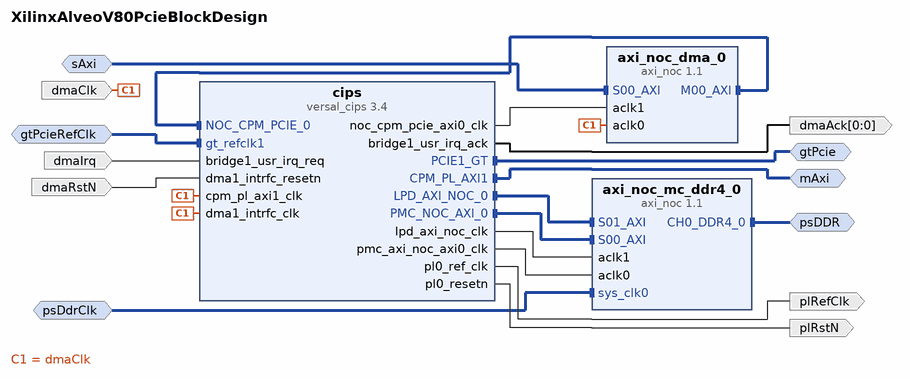
[diagram p0: block diagram of the top level]
# Vivado block design XilinxAlveoV80PcieBlockDesign, xcv80-lsva4737-2MHP-e-S, Vivado 2025.2
create_bd_design XilinxAlveoV80PcieBlockDesign

create_bd_intf_port -mode Master -vlnv xilinx.com:interface:ddr4_rtl:1.0 psDDR
create_bd_intf_port -mode Slave -vlnv xilinx.com:interface:diff_clock_rtl:1.0 psDdrClk
set_property -dict {CONFIG.FREQ_HZ 200000000} [get_bd_intf_ports psDdrClk]
create_bd_intf_port -mode Slave -vlnv xilinx.com:interface:diff_clock_rtl:1.0 gtPcieRefClk
set_property -dict {CONFIG.FREQ_HZ 100000000} [get_bd_intf_ports gtPcieRefClk]
create_bd_intf_port -mode Master -vlnv xilinx.com:interface:gt_rtl:1.0 gtPcie
create_bd_intf_port -mode Slave -vlnv xilinx.com:interface:aximm_rtl:1.0 sAxi
set_property -dict [list \
  CONFIG.ADDR_WIDTH 64 \
  CONFIG.ARUSER_WIDTH 0 \
  CONFIG.AWUSER_WIDTH 0 \
  CONFIG.BUSER_WIDTH 0 \
  CONFIG.DATA_WIDTH 512 \
  CONFIG.FREQ_HZ 250000000 \
  CONFIG.HAS_BRESP 1 \
  CONFIG.HAS_BURST 1 \
  CONFIG.HAS_CACHE 1 \
  CONFIG.HAS_LOCK 1 \
  CONFIG.HAS_PROT 1 \
  CONFIG.HAS_QOS 1 \
  CONFIG.HAS_REGION 1 \
  CONFIG.HAS_RRESP 1 \
  CONFIG.HAS_WSTRB 1 \
  CONFIG.ID_WIDTH 4 \
  CONFIG.MAX_BURST_LENGTH 256 \
  CONFIG.NUM_READ_OUTSTANDING 8 \
  CONFIG.NUM_READ_THREADS 1 \
  CONFIG.NUM_WRITE_OUTSTANDING 8 \
  CONFIG.NUM_WRITE_THREADS 1 \
  CONFIG.PROTOCOL AXI4 \
  CONFIG.READ_WRITE_MODE READ_WRITE \
  CONFIG.RUSER_BITS_PER_BYTE 0 \
  CONFIG.RUSER_WIDTH 0 \
  CONFIG.SUPPORTS_NARROW_BURST 1 \
  CONFIG.WUSER_BITS_PER_BYTE 0 \
  CONFIG.WUSER_WIDTH 0 \
] [get_bd_intf_ports sAxi]
create_bd_intf_port -mode Master -vlnv xilinx.com:interface:aximm_rtl:1.0 mAxi
set_property -dict [list \
  CONFIG.ADDR_WIDTH 64 \
  CONFIG.DATA_WIDTH 512 \
  CONFIG.FREQ_HZ 250000000 \
  CONFIG.NUM_READ_OUTSTANDING 0 \
  CONFIG.NUM_WRITE_OUTSTANDING 0 \
  CONFIG.PROTOCOL AXI4 \
] [get_bd_intf_ports mAxi]
create_bd_port -dir I -type clk dmaClk
set_property -dict [list \
  CONFIG.ASSOCIATED_BUSIF sAxi:mAxi \
  CONFIG.ASSOCIATED_RESET dmaRstN:dmaAck \
  CONFIG.FREQ_HZ 250000000 \
] [get_bd_ports dmaClk]
create_bd_port -dir O -type rst plRstN
create_bd_port -dir O -type clk plRefClk
create_bd_port -dir I -type intr dmaIrq
set_property -dict {CONFIG.SENSITIVITY EDGE_RISING} [get_bd_ports dmaIrq]
create_bd_port -dir I -type rst dmaRstN
create_bd_port -dir O -from 0 -to 0 -type rst dmaAck

create_bd_cell -type ip -vlnv xilinx.com:ip:versal_cips:3.4 cips
set_property -dict [list \
  CONFIG.CLOCK_MODE Custom \
  CONFIG.CPM_CONFIG {['CPM_AXI_SLV_BRIDGE0_BASE_ADDRR_H 0x00000000 CPM_AXI_SLV_BRIDGE1_BASE_ADDRR_H 0x00000000 CPM_PCIE0_ACS_CAP_ON 0 CPM_PCIE0_ARI_CAP_ENABLED 0 CPM_PCIE0_BRIDGE_AXI_SLAVE_IF 1 CPM_PCIE0_CFG_EXT_IF 0', 'CPM_PCIE0_CFG_VEND_ID 1A4A CPM_PCIE0_FUNCTIONAL_MODE None CPM_PCIE0_MAX_LINK_SPEED 32.0_GT/s CPM_PCIE0_MODES None CPM_PCIE0_MODE_SELECTION Advanced CPM_PCIE0_MSI_X_OPTIONS MSI-X_External', 'CPM_PCIE0_NUM_USR_IRQ 1 CPM_PCIE0_PCIE_REGION_0_EN 0 CPM_PCIE0_PCIE_REGION_2_EN 1 CPM_PCIE0_PCIE_REGION_2_SCALE Gigabytes CPM_PCIE0_PCIE_REGION_2_SIZE 128 CPM_PCIE0_PF0_BAR0_BRIDGE_SCALE Kilobytes', 'CPM_PCIE0_PF0_BAR0_BRIDGE_SIZE 4 CPM_PCIE0_PF0_BAR0_BRIDGE_STEERING CPM_PCIE_NOC_0 CPM_PCIE0_PF0_BAR0_SCALE Megabytes CPM_PCIE0_PF0_BAR0_SIZE 16 CPM_PCIE0_PF0_BASE_CLASS_VALUE 11', 'CPM_PCIE0_PF0_CFG_DEV_ID 2030 CPM_PCIE0_PF0_CFG_SUBSYS_ID 2030 CPM_PCIE0_PF0_CFG_SUBSYS_VEND_ID 1A4A CPM_PCIE0_PF0_INTERRUPT_PIN NONE CPM_PCIE0_PF0_MSI_ENABLED 0 CPM_PCIE0_PF0_PM_CAP_PMESUPPORT_D0 0', 'CPM_PCIE0_PF0_PM_CAP_PMESUPPORT_D1 0 CPM_PCIE0_PF0_PM_CAP_PMESUPPORT_D3HOT 0 CPM_PCIE0_PF0_PM_CAP_SUPP_D1_STATE 0 CPM_PCIE1_ACS_CAP_ON 0 CPM_PCIE1_ARI_CAP_ENABLED 0 CPM_PCIE1_BRIDGE_AXI_SLAVE_IF 1', 'CPM_PCIE1_CFG_EXT_IF 0 CPM_PCIE1_CFG_VEND_ID 1A4A CPM_PCIE1_COPY_PF0_QDMA_ENABLED 0 CPM_PCIE1_EXT_PCIE_CFG_SPACE_ENABLED None CPM_PCIE1_FUNCTIONAL_MODE AXI_Bridge CPM_PCIE1_MAX_LINK_SPEED 32.0_GT/s', 'CPM_PCIE1_MODES DMA CPM_PCIE1_MODE_SELECTION Advanced CPM_PCIE1_MSI_X_OPTIONS None CPM_PCIE1_NUM_USR_IRQ 1 CPM_PCIE1_PCIE_REGION_0_EN 0 CPM_PCIE1_PCIE_REGION_2_EN 1 CPM_PCIE1_PCIE_REGION_2_SCALE', 'Gigabytes CPM_PCIE1_PCIE_REGION_2_SIZE 128 CPM_PCIE1_PF0_AXIBAR2PCIE_BASEADDR_0 0x0000008000000000 CPM_PCIE1_PF0_AXIBAR2PCIE_BASEADDR_1 0x0000008040000000 CPM_PCIE1_PF0_AXIBAR2PCIE_BASEADDR_2', '0x0000008080000000 CPM_PCIE1_PF0_AXIBAR2PCIE_BASEADDR_3 0x00000080C0000000 CPM_PCIE1_PF0_AXIBAR2PCIE_BASEADDR_4 0x0000008100000000 CPM_PCIE1_PF0_AXIBAR2PCIE_BASEADDR_5 0x0000008140000000', 'CPM_PCIE1_PF0_AXIBAR2PCIE_HIGHADDR_0 0x000000803FFFFFFFF CPM_PCIE1_PF0_AXIBAR2PCIE_HIGHADDR_1 0x000000807FFFFFFFF CPM_PCIE1_PF0_AXIBAR2PCIE_HIGHADDR_2 0x00000080BFFFFFFFF', 'CPM_PCIE1_PF0_AXIBAR2PCIE_HIGHADDR_3 0x00000080FFFFFFFFF CPM_PCIE1_PF0_AXIBAR2PCIE_HIGHADDR_4 0x000000813FFFFFFFF CPM_PCIE1_PF0_AXIBAR2PCIE_HIGHADDR_5 0x000000817FFFFFFFF CPM_PCIE1_PF0_BAR0_64BIT 1', 'CPM_PCIE1_PF0_BAR0_BRIDGE_64BIT 1 CPM_PCIE1_PF0_BAR0_BRIDGE_SCALE Megabytes CPM_PCIE1_PF0_BAR0_BRIDGE_SIZE 16 CPM_PCIE1_PF0_BAR0_BRIDGE_STEERING CPM_PL_AXI1 CPM_PCIE1_PF0_BAR0_PREFETCHABLE 0', 'CPM_PCIE1_PF0_BAR0_QDMA_64BIT 0 CPM_PCIE1_PF0_BAR0_QDMA_ENABLED 0 CPM_PCIE1_PF0_BAR0_QDMA_PREFETCHABLE 0 CPM_PCIE1_PF0_BAR0_QDMA_SCALE Kilobytes CPM_PCIE1_PF0_BAR0_QDMA_SIZE 4', 'CPM_PCIE1_PF0_BAR0_QDMA_TYPE AXI_Bridge_Master CPM_PCIE1_PF0_BAR0_SIZE 16 CPM_PCIE1_PF0_BAR1_BRIDGE_ENABLED 0 CPM_PCIE1_PF0_BAR2_QDMA_64BIT 0 CPM_PCIE1_PF0_BAR2_QDMA_ENABLED 0', 'CPM_PCIE1_PF0_BAR2_QDMA_PREFETCHABLE 0 CPM_PCIE1_PF0_BAR2_QDMA_SCALE Kilobytes CPM_PCIE1_PF0_BAR2_QDMA_SIZE 4 CPM_PCIE1_PF0_BAR2_QDMA_TYPE AXI_Bridge_Master CPM_PCIE1_PF0_BASE_CLASS_VALUE 11', 'CPM_PCIE1_PF0_CFG_DEV_ID 2030 CPM_PCIE1_PF0_CFG_SUBSYS_ID 2030 CPM_PCIE1_PF0_CFG_SUBSYS_VEND_ID 1A4A CPM_PCIE1_PF0_DEV_CAP_EXT_TAG_EN 1 CPM_PCIE1_PF0_DEV_CAP_FUNCTION_LEVEL_RESET_CAPABLE 0', 'CPM_PCIE1_PF0_INTERRUPT_PIN NONE CPM_PCIE1_PF0_MSIX_CAP_TABLE_OFFSET 40 CPM_PCIE1_PF0_MSIX_CAP_TABLE_SIZE 1 CPM_PCIE1_PF0_MSIX_ENABLED 0 CPM_PCIE1_PF0_MSI_ENABLED 1 CPM_PCIE1_PF0_PCIEBAR2AXIBAR_QDMA_0', '0x0000020100000000 CPM_PCIE1_PF0_PM_CAP_PMESUPPORT_D0 0 CPM_PCIE1_PF0_PM_CAP_PMESUPPORT_D1 0 CPM_PCIE1_PF0_PM_CAP_PMESUPPORT_D3HOT 0 CPM_PCIE1_PF0_PM_CAP_SUPP_D1_STATE 0 CPM_PCIE1_PF0_SUB_CLASS_VALUE', '80 CPM_PCIE1_PF1_BAR0_QDMA_64BIT 0 CPM_PCIE1_PF1_BAR0_QDMA_ENABLED 0 CPM_PCIE1_PF1_BAR0_QDMA_PREFETCHABLE 0 CPM_PCIE1_PF1_BAR0_QDMA_SCALE Kilobytes CPM_PCIE1_PF1_BAR0_QDMA_SIZE 4', 'CPM_PCIE1_PF1_BAR0_QDMA_TYPE AXI_Bridge_Master CPM_PCIE1_PF1_BAR2_QDMA_64BIT 0 CPM_PCIE1_PF1_BAR2_QDMA_ENABLED 0 CPM_PCIE1_PF1_BAR2_QDMA_PREFETCHABLE 0 CPM_PCIE1_PF1_BAR2_QDMA_SCALE Kilobytes', 'CPM_PCIE1_PF1_BAR2_QDMA_SIZE 4 CPM_PCIE1_PF1_BAR2_QDMA_TYPE AXI_Bridge_Master CPM_PCIE1_PF1_BASE_CLASS_VALUE 05 CPM_PCIE1_PF1_CFG_DEV_ID 0 CPM_PCIE1_PF1_CFG_SUBSYS_ID 0', 'CPM_PCIE1_PF1_CFG_SUBSYS_VEND_ID 0 CPM_PCIE1_PF1_MSIX_CAP_TABLE_OFFSET 50000 CPM_PCIE1_PF1_MSIX_CAP_TABLE_SIZE 8 CPM_PCIE1_PF1_MSIX_ENABLED 1 CPM_PCIE1_PF1_PCIEBAR2AXIBAR_QDMA_2 0x0000020200000000', 'CPM_PCIE1_PF1_SUB_CLASS_VALUE 00 CPM_PCIE1_PL_LINK_CAP_MAX_LINK_WIDTH X8 CPM_PCIE1_PORT_TYPE PCI_Express_Endpoint_device CPM_PCIE1_TL_PF_ENABLE_REG 1 CPM_PL_AXI0_EN 0 CPM_PL_AXI1_EN 1', 'PS_USE_PS_NOC_PCI_0 0 PS_USE_PS_NOC_PCI_1 0']} \
  CONFIG.PS_PL_CONNECTIVITY_MODE Custom \
  CONFIG.PS_PMC_CONFIG {['BOOT_MODE Custom', 'CLOCK_MODE Custom', 'DDR_MEMORY_MODE Custom', 'DESIGN_MODE 1', 'DEVICE_INTEGRITY_MODE Custom', 'IO_CONFIG_MODE Custom', 'PCIE_APERTURES_DUAL_ENABLE 0', 'PCIE_APERTURES_SINGLE_ENABLE 1', 'PMC_BANK_1_IO_STANDARD LVCMOS3.3', 'PMC_CRP_OSPI_REF_CTRL_FREQMHZ 200', 'PMC_CRP_PL0_REF_CTRL_FREQMHZ 250', 'PMC_CRP_PL1_REF_CTRL_FREQMHZ 33.3333333', 'PMC_CRP_PL2_REF_CTRL_FREQMHZ 250', 'PMC_GLITCH_CONFIG {{DEPTH_SENSITIVITY 1} {MIN_PULSE_WIDTH 0.5} {TYPE CUSTOM} {VCC_PMC_VALUE 0.88}}', 'PMC_GLITCH_CONFIG_1 {{DEPTH_SENSITIVITY 1} {MIN_PULSE_WIDTH 0.5} {TYPE CUSTOM} {VCC_PMC_VALUE 0.88}}', 'PMC_GLITCH_CONFIG_2 {{DEPTH_SENSITIVITY 1} {MIN_PULSE_WIDTH 0.5} {TYPE CUSTOM} {VCC_PMC_VALUE 0.88}}', 'PMC_GPIO_EMIO_PERIPHERAL_ENABLE 0', 'PMC_MIO11 {{AUX_IO 0} {DIRECTION in} {DRIVE_STRENGTH 8mA} {OUTPUT_DATA default} {PULL pullup} {SCHMITT 0} {SLEW slow} {USAGE GPIO}}', 'PMC_MIO12 {{AUX_IO 0} {DIRECTION out} {DRIVE_STRENGTH 8mA} {OUTPUT_DATA default} {PULL pullup} {SCHMITT 0} {SLEW slow} {USAGE GPIO}}', 'PMC_MIO13 {{AUX_IO 0} {DIRECTION inout} {DRIVE_STRENGTH 8mA} {OUTPUT_DATA default} {PULL pullup} {SCHMITT 0} {SLEW slow} {USAGE Reserved}}', 'PMC_MIO17 {{AUX_IO 0} {DIRECTION out} {DRIVE_STRENGTH 8mA} {OUTPUT_DATA default} {PULL pullup} {SCHMITT 0} {SLEW slow} {USAGE GPIO}}', 'PMC_MIO26 {{AUX_IO 0} {DIRECTION out} {DRIVE_STRENGTH 8mA} {OUTPUT_DATA default} {PULL pullup} {SCHMITT 0} {SLEW slow} {USAGE GPIO}}', 'PMC_MIO27 {{AUX_IO 0} {DIRECTION out} {DRIVE_STRENGTH 8mA} {OUTPUT_DATA default} {PULL pullup} {SCHMITT 0} {SLEW slow} {USAGE GPIO}}', 'PMC_MIO28 {{AUX_IO 0} {DIRECTION out} {DRIVE_STRENGTH 8mA} {OUTPUT_DATA default} {PULL pullup} {SCHMITT 0} {SLEW slow} {USAGE GPIO}}', 'PMC_MIO29 {{AUX_IO 0} {DIRECTION out} {DRIVE_STRENGTH 8mA} {OUTPUT_DATA default} {PULL pullup} {SCHMITT 0} {SLEW slow} {USAGE GPIO}}', 'PMC_MIO30 {{AUX_IO 0} {DIRECTION out} {DRIVE_STRENGTH 8mA} {OUTPUT_DATA default} {PULL pullup} {SCHMITT 0} {SLEW slow} {USAGE GPIO}}', 'PMC_MIO31 {{AUX_IO 0} {DIRECTION out} {DRIVE_STRENGTH 8mA} {OUTPUT_DATA default} {PULL pullup} {SCHMITT 0} {SLEW slow} {USAGE GPIO}}', 'PMC_MIO32 {{AUX_IO 0} {DIRECTION out} {DRIVE_STRENGTH 8mA} {OUTPUT_DATA default} {PULL pullup} {SCHMITT 0} {SLEW slow} {USAGE GPIO}}', 'PMC_MIO33 {{AUX_IO 0} {DIRECTION in} {DRIVE_STRENGTH 8mA} {OUTPUT_DATA default} {PULL pullup} {SCHMITT 0} {SLEW slow} {USAGE GPIO}}', 'PMC_MIO34 {{AUX_IO 0} {DIRECTION out} {DRIVE_STRENGTH 8mA} {OUTPUT_DATA default} {PULL pullup} {SCHMITT 0} {SLEW slow} {USAGE GPIO}}', 'PMC_MIO35 {{AUX_IO 0} {DIRECTION out} {DRIVE_STRENGTH 8mA} {OUTPUT_DATA default} {PULL pullup} {SCHMITT 0} {SLEW slow} {USAGE GPIO}}', 'PMC_MIO36 {{AUX_IO 0} {DIRECTION out} {DRIVE_STRENGTH 8mA} {OUTPUT_DATA default} {PULL pullup} {SCHMITT 0} {SLEW slow} {USAGE GPIO}}', 'PMC_MIO37 {{AUX_IO 0} {DIRECTION in} {DRIVE_STRENGTH 8mA} {OUTPUT_DATA default} {PULL pullup} {SCHMITT 0} {SLEW slow} {USAGE GPIO}}', 'PMC_MIO38 {{AUX_IO 0} {DIRECTION out} {DRIVE_STRENGTH 8mA} {OUTPUT_DATA default} {PULL pullup} {SCHMITT 0} {SLEW slow} {USAGE GPIO}}', 'PMC_MIO39 {{AUX_IO 0} {DIRECTION out} {DRIVE_STRENGTH 8mA} {OUTPUT_DATA default} {PULL pullup} {SCHMITT 0} {SLEW slow} {USAGE GPIO}}', 'PMC_MIO40 {{AUX_IO 0} {DIRECTION out} {DRIVE_STRENGTH 8mA} {OUTPUT_DATA default} {PULL pullup} {SCHMITT 0} {SLEW slow} {USAGE GPIO}}', 'PMC_MIO41 {{AUX_IO 0} {DIRECTION in} {DRIVE_STRENGTH 8mA} {OUTPUT_DATA default} {PULL pullup} {SCHMITT 0} {SLEW slow} {USAGE GPIO}}', 'PMC_MIO42 {{AUX_IO 0} {DIRECTION out} {DRIVE_STRENGTH 8mA} {OUTPUT_DATA default} {PULL pullup} {SCHMITT 0} {SLEW slow} {USAGE GPIO}}', 'PMC_MIO43 {{AUX_IO 0} {DIRECTION out} {DRIVE_STRENGTH 8mA} {OUTPUT_DATA default} {PULL pullup} {SCHMITT 0} {SLEW slow} {USAGE GPIO}}', 'PMC_MIO44 {{AUX_IO 0} {DIRECTION out} {DRIVE_STRENGTH 8mA} {OUTPUT_DATA default} {PULL pullup} {SCHMITT 0} {SLEW slow} {USAGE GPIO}}', 'PMC_MIO48 {{AUX_IO 0} {DIRECTION in} {DRIVE_STRENGTH 8mA} {OUTPUT_DATA default} {PULL pullup} {SCHMITT 0} {SLEW slow} {USAGE GPIO}}', 'PMC_MIO49 {{AUX_IO 0} {DIRECTION in} {DRIVE_STRENGTH 8mA} {OUTPUT_DATA default} {PULL pullup} {SCHMITT 0} {SLEW slow} {USAGE GPIO}}', 'PMC_MIO50 {{AUX_IO 0} {DIRECTION in} {DRIVE_STRENGTH 8mA} {OUTPUT_DATA default} {PULL pullup} {SCHMITT 0} {SLEW slow} {USAGE GPIO}}', 'PMC_MIO51 {{AUX_IO 0} {DIRECTION out} {DRIVE_STRENGTH 8mA} {OUTPUT_DATA default} {PULL pullup} {SCHMITT 0} {SLEW slow} {USAGE GPIO}}', 'PMC_MIO_EN_FOR_PL_PCIE 0', 'PMC_OSPI_PERIPHERAL {{ENABLE 1} {IO {PMC_MIO 0 .. 11}} {MODE Single}}', 'PMC_REF_CLK_FREQMHZ 33.333333', 'PMC_SD0_DATA_TRANSFER_MODE 8Bit', 'PMC_SD0_PERIPHERAL {{CLK_100_SDR_OTAP_DLY 0x00} {CLK_200_SDR_OTAP_DLY 0x2} {CLK_50_DDR_ITAP_DLY 0x1E} {CLK_50_DDR_OTAP_DLY 0x5} {CLK_50_SDR_ITAP_DLY 0x2C} {CLK_50_SDR_OTAP_DLY 0x5} {ENABLE 1} {IO {PMC_MIO 13 .. 25}}}', 'PMC_SD0_SLOT_TYPE eMMC', 'PMC_USE_PMC_NOC_AXI0 1', 'PS_BANK_2_IO_STANDARD LVCMOS3.3', 'PS_BOARD_INTERFACE Custom', 'PS_CRL_CPM_TOPSW_REF_CTRL_FREQMHZ 1000', 'PS_GEN_IPI0_ENABLE 0', 'PS_GEN_IPI1_ENABLE 0', 'PS_GEN_IPI2_ENABLE 0', 'PS_GEN_IPI3_ENABLE 1', 'PS_GEN_IPI3_MASTER R5_0', 'PS_GEN_IPI4_ENABLE 1', 'PS_GEN_IPI4_MASTER R5_0', 'PS_GEN_IPI5_ENABLE 1', 'PS_GEN_IPI5_MASTER R5_1', 'PS_GEN_IPI6_ENABLE 1', 'PS_GEN_IPI6_MASTER R5_1', 'PS_GPIO_EMIO_PERIPHERAL_ENABLE 0', 'PS_I2C0_PERIPHERAL {{ENABLE 1} {IO {PS_MIO 2 .. 3}}}', 'PS_I2C1_PERIPHERAL {{ENABLE 1} {IO {PS_MIO 0 .. 1}}}', 'PS_IRQ_USAGE {{CH0 0} {CH1 0} {CH10 0} {CH11 0} {CH12 0} {CH13 0} {CH14 0} {CH15 0} {CH2 0} {CH3 0} {CH4 0} {CH5 0} {CH6 0} {CH7 0} {CH8 0} {CH9 0}}', 'PS_KAT_ENABLE 0', 'PS_KAT_ENABLE_1 0', 'PS_KAT_ENABLE_2 0', 'PS_MIO10 {{AUX_IO 0} {DIRECTION in} {DRIVE_STRENGTH 8mA} {OUTPUT_DATA default} {PULL pullup} {SCHMITT 0} {SLEW slow} {USAGE GPIO}}', 'PS_MIO11 {{AUX_IO 0} {DIRECTION in} {DRIVE_STRENGTH 8mA} {OUTPUT_DATA default} {PULL pullup} {SCHMITT 0} {SLEW slow} {USAGE GPIO}}', 'PS_MIO12 {{AUX_IO 0} {DIRECTION inout} {DRIVE_STRENGTH 8mA} {OUTPUT_DATA default} {PULL pullup} {SCHMITT 0} {SLEW slow} {USAGE Reserved}}', 'PS_MIO13 {{AUX_IO 0} {DIRECTION out} {DRIVE_STRENGTH 8mA} {OUTPUT_DATA default} {PULL pullup} {SCHMITT 0} {SLEW slow} {USAGE GPIO}}', 'PS_MIO14 {{AUX_IO 0} {DIRECTION in} {DRIVE_STRENGTH 8mA} {OUTPUT_DATA default} {PULL pullup} {SCHMITT 0} {SLEW slow} {USAGE GPIO}}', 'PS_MIO18 {{AUX_IO 0} {DIRECTION out} {DRIVE_STRENGTH 8mA} {OUTPUT_DATA default} {PULL pullup} {SCHMITT 0} {SLEW slow} {USAGE GPIO}}', 'PS_MIO19 {{AUX_IO 0} {DIRECTION out} {DRIVE_STRENGTH 8mA} {OUTPUT_DATA default} {PULL pullup} {SCHMITT 0} {SLEW slow} {USAGE GPIO}}', 'PS_MIO22 {{AUX_IO 0} {DIRECTION out} {DRIVE_STRENGTH 8mA} {OUTPUT_DATA default} {PULL pullup} {SCHMITT 0} {SLEW slow} {USAGE GPIO}}', 'PS_MIO23 {{AUX_IO 0} {DIRECTION out} {DRIVE_STRENGTH 8mA} {OUTPUT_DATA default} {PULL pullup} {SCHMITT 0} {SLEW slow} {USAGE GPIO}}', 'PS_MIO24 {{AUX_IO 0} {DIRECTION out} {DRIVE_STRENGTH 8mA} {OUTPUT_DATA default} {PULL pullup} {SCHMITT 0} {SLEW slow} {USAGE GPIO}}', 'PS_MIO25 {{AUX_IO 0} {DIRECTION in} {DRIVE_STRENGTH 8mA} {OUTPUT_DATA default} {PULL pullup} {SCHMITT 0} {SLEW slow} {USAGE GPIO}}', 'PS_MIO4 {{AUX_IO 0} {DIRECTION out} {DRIVE_STRENGTH 8mA} {OUTPUT_DATA default} {PULL pullup} {SCHMITT 0} {SLEW slow} {USAGE GPIO}}', 'PS_MIO5 {{AUX_IO 0} {DIRECTION in} {DRIVE_STRENGTH 8mA} {OUTPUT_DATA default} {PULL pullup} {SCHMITT 0} {SLEW slow} {USAGE GPIO}}', 'PS_MIO6 {{AUX_IO 0} {DIRECTION out} {DRIVE_STRENGTH 8mA} {OUTPUT_DATA default} {PULL pullup} {SCHMITT 0} {SLEW slow} {USAGE GPIO}}', 'PS_MIO7 {{AUX_IO 0} {DIRECTION out} {DRIVE_STRENGTH 8mA} {OUTPUT_DATA default} {PULL pullup} {SCHMITT 0} {SLEW slow} {USAGE GPIO}}', 'PS_MIO8 {{AUX_IO 0} {DIRECTION in} {DRIVE_STRENGTH 8mA} {OUTPUT_DATA default} {PULL pullup} {SCHMITT 0} {SLEW slow} {USAGE Reserved}}', 'PS_MIO9 {{AUX_IO 0} {DIRECTION out} {DRIVE_STRENGTH 8mA} {OUTPUT_DATA default} {PULL pullup} {SCHMITT 1} {SLEW slow} {USAGE Reserved}}', 'PS_M_AXI_LPD_DATA_WIDTH 128', 'PS_NUM_FABRIC_RESETS 1', 'PS_PCIE1_PERIPHERAL_ENABLE 0', 'PS_PCIE2_PERIPHERAL_ENABLE 1', 'PS_PCIE_EP_RESET1_IO {PMC_MIO 24}', 'PS_PCIE_EP_RESET2_IO {PMC_MIO 25}', 'PS_PCIE_RESET {ENABLE 1}', 'PS_PL_CONNECTIVITY_MODE Custom', 'PS_SPI0 {{GRP_SS0_ENABLE 1} {GRP_SS0_IO {PS_MIO 15}} {GRP_SS1_ENABLE 0} {GRP_SS1_IO {PMC_MIO 14}} {GRP_SS2_ENABLE 0} {GRP_SS2_IO {PMC_MIO 13}} {PERIPHERAL_ENABLE 1} {PERIPHERAL_IO {PS_MIO 12 .. 17}}}', 'PS_SPI1 {{GRP_SS0_ENABLE 0} {GRP_SS0_IO {PS_MIO 9}} {GRP_SS1_ENABLE 0} {GRP_SS1_IO {PS_MIO 8}} {GRP_SS2_ENABLE 0} {GRP_SS2_IO {PS_MIO 7}} {PERIPHERAL_ENABLE 0} {PERIPHERAL_IO {PS_MIO 6 .. 11}}}', 'PS_TTC0_PERIPHERAL_ENABLE 1', 'PS_TTC1_PERIPHERAL_ENABLE 1', 'PS_TTC2_PERIPHERAL_ENABLE 1', 'PS_TTC3_PERIPHERAL_ENABLE 1', 'PS_UART0_PERIPHERAL {{ENABLE 1} {IO {PS_MIO 8 .. 9}}}', 'PS_UART1_PERIPHERAL {{ENABLE 1} {IO {PS_MIO 20 .. 21}}}', 'PS_USE_FPD_CCI_NOC 0', 'PS_USE_M_AXI_FPD 0', 'PS_USE_M_AXI_LPD 0', 'PS_USE_NOC_LPD_AXI0 1', 'PS_USE_PMCPL_CLK0 1', 'PS_USE_PMCPL_CLK1 0', 'PS_USE_PMCPL_CLK2 0', 'PS_USE_S_AXI_LPD 0', 'SMON_ALARMS Set_Alarms_On', 'SMON_ENABLE_TEMP_AVERAGING 0', 'SMON_MEAS100 {{ALARM_ENABLE 1} {ALARM_LOWER 0.00} {ALARM_UPPER 4.00} {AVERAGE_EN 0} {ENABLE 1} {MODE {4 V unipolar}} {NAME VCCO_500} {SUPPLY_NUM 9}}', 'SMON_MEAS101 {{ALARM_ENABLE 1} {ALARM_LOWER 0.00} {ALARM_UPPER 4.00} {AVERAGE_EN 0} {ENABLE 1} {MODE {4 V unipolar}} {NAME VCCO_501} {SUPPLY_NUM 10}}', 'SMON_MEAS102 {{ALARM_ENABLE 1} {ALARM_LOWER 0.00} {ALARM_UPPER 4.00} {AVERAGE_EN 0} {ENABLE 1} {MODE {4 V unipolar}} {NAME VCCO_502} {SUPPLY_NUM 11}}', 'SMON_MEAS103 {{ALARM_ENABLE 1} {ALARM_LOWER 0.00} {ALARM_UPPER 4.00} {AVERAGE_EN 0} {ENABLE 1} {MODE {4 V unipolar}} {NAME VCCO_503} {SUPPLY_NUM 12}}', 'SMON_MEAS104 {{ALARM_ENABLE 1} {ALARM_LOWER 0.00} {ALARM_UPPER 2.00} {AVERAGE_EN 0} {ENABLE 1} {MODE {2 V unipolar}} {NAME VCCO_700} {SUPPLY_NUM 13}}', 'SMON_MEAS105 {{ALARM_ENABLE 1} {ALARM_LOWER 0.00} {ALARM_UPPER 2.00} {AVERAGE_EN 0} {ENABLE 1} {MODE {2 V unipolar}} {NAME VCCO_701} {SUPPLY_NUM 14}}', 'SMON_MEAS106 {{ALARM_ENABLE 1} {ALARM_LOWER 0.00} {ALARM_UPPER 2.00} {AVERAGE_EN 0} {ENABLE 1} {MODE {2 V unipolar}} {NAME VCCO_702} {SUPPLY_NUM 15}}', 'SMON_MEAS118 {{ALARM_ENABLE 1} {ALARM_LOWER 0.00} {ALARM_UPPER 2.00} {AVERAGE_EN 0} {ENABLE 1} {MODE {2 V unipolar}} {NAME VCC_PMC} {SUPPLY_NUM 0}}', 'SMON_MEAS119 {{ALARM_ENABLE 1} {ALARM_LOWER 0.00} {ALARM_UPPER 2.00} {AVERAGE_EN 0} {ENABLE 1} {MODE {2 V unipolar}} {NAME VCC_PSFP} {SUPPLY_NUM 1}}', 'SMON_MEAS120 {{ALARM_ENABLE 1} {ALARM_LOWER 0.00} {ALARM_UPPER 2.00} {AVERAGE_EN 0} {ENABLE 1} {MODE {2 V unipolar}} {NAME VCC_PSLP} {SUPPLY_NUM 2}}', 'SMON_MEAS121 {{ALARM_ENABLE 1} {ALARM_LOWER 0.00} {ALARM_UPPER 2.00} {AVERAGE_EN 0} {ENABLE 1} {MODE {2 V unipolar}} {NAME VCC_RAM} {SUPPLY_NUM 3}}', 'SMON_MEAS122 {{ALARM_ENABLE 1} {ALARM_LOWER 0.00} {ALARM_UPPER 2.00} {AVERAGE_EN 0} {ENABLE 1} {MODE {2 V unipolar}} {NAME VCC_SOC} {SUPPLY_NUM 4}}', 'SMON_MEAS47 {{ALARM_ENABLE 1} {ALARM_LOWER 0.00} {ALARM_UPPER 2.00} {AVERAGE_EN 0} {ENABLE 1} {MODE {2 V unipolar}} {NAME GTYP_AVCCAUX_104} {SUPPLY_NUM 20}}', 'SMON_MEAS48 {{ALARM_ENABLE 1} {ALARM_LOWER 0.00} {ALARM_UPPER 2.00} {AVERAGE_EN 0} {ENABLE 1} {MODE {2 V unipolar}} {NAME GTYP_AVCCAUX_105} {SUPPLY_NUM 21}}', 'SMON_MEAS64 {{ALARM_ENABLE 1} {ALARM_LOWER 0.00} {ALARM_UPPER 2.00} {AVERAGE_EN 0} {ENABLE 1} {MODE {2 V unipolar}} {NAME GTYP_AVCC_104} {SUPPLY_NUM 18}}', 'SMON_MEAS65 {{ALARM_ENABLE 1} {ALARM_LOWER 0.00} {ALARM_UPPER 2.00} {AVERAGE_EN 0} {ENABLE 1} {MODE {2 V unipolar}} {NAME GTYP_AVCC_105} {SUPPLY_NUM 19}}', 'SMON_MEAS81 {{ALARM_ENABLE 1} {ALARM_LOWER 0.00} {ALARM_UPPER 2.00} {AVERAGE_EN 0} {ENABLE 1} {MODE {2 V unipolar}} {NAME GTYP_AVTT_104} {SUPPLY_NUM 22}}', 'SMON_MEAS82 {{ALARM_ENABLE 1} {ALARM_LOWER 0.00} {ALARM_UPPER 2.00} {AVERAGE_EN 0} {ENABLE 1} {MODE {2 V unipolar}} {NAME GTYP_AVTT_105} {SUPPLY_NUM 23}}', 'SMON_MEAS96 {{ALARM_ENABLE 1} {ALARM_LOWER 0.00} {ALARM_UPPER 2.00} {AVERAGE_EN 0} {ENABLE 1} {MODE {2 V unipolar}} {NAME VCCAUX} {SUPPLY_NUM 6}}', 'SMON_MEAS97 {{ALARM_ENABLE 1} {ALARM_LOWER 0.00} {ALARM_UPPER 2.00} {AVERAGE_EN 0} {ENABLE 1} {MODE {2 V unipolar}} {NAME VCCAUX_PMC} {SUPPLY_NUM 7}}', 'SMON_MEAS98 {{ALARM_ENABLE 1} {ALARM_LOWER 0.00} {ALARM_UPPER 2.00} {AVERAGE_EN 0} {ENABLE 1} {MODE {2 V unipolar}} {NAME VCCAUX_SMON} {SUPPLY_NUM 8}}', 'SMON_MEAS99 {{ALARM_ENABLE 1} {ALARM_LOWER 0.00} {ALARM_UPPER 2.00} {AVERAGE_EN 0} {ENABLE 1} {MODE {2 V unipolar}} {NAME VCCINT} {SUPPLY_NUM 5}}', 'SMON_TEMP_AVERAGING_SAMPLES 0', 'SMON_VOLTAGE_AVERAGING_SAMPLES 8']} \
  CONFIG.PS_PMC_CONFIG_APPLIED 1 \
] [get_bd_cells cips]
create_bd_cell -type ip -vlnv xilinx.com:ip:axi_noc:1.1 axi_noc_mc_ddr4_0
set_property -dict [list \
  CONFIG.CONTROLLERTYPE DDR4_SDRAM \
  CONFIG.MC_CHAN_REGION1 DDR_CH1 \
  CONFIG.MC_COMPONENT_WIDTH x16 \
  CONFIG.MC_DATAWIDTH 72 \
  CONFIG.MC_DM_WIDTH 9 \
  CONFIG.MC_DQS_WIDTH 9 \
  CONFIG.MC_DQ_WIDTH 72 \
  CONFIG.MC_INIT_MEM_USING_ECC_SCRUB true \
  CONFIG.MC_INPUTCLK0_PERIOD 5000 \
  CONFIG.MC_MEMORY_DEVICETYPE Components \
  CONFIG.MC_MEMORY_SPEEDGRADE {DDR4-3200AA(22-22-22)} \
  CONFIG.MC_NO_CHANNELS Single \
  CONFIG.MC_RANK 1 \
  CONFIG.MC_ROWADDRESSWIDTH 16 \
  CONFIG.MC_STACKHEIGHT 1 \
  CONFIG.MC_SYSTEM_CLOCK Differential \
  CONFIG.NUM_CLKS 2 \
  CONFIG.NUM_MC 1 \
  CONFIG.NUM_MCP 4 \
  CONFIG.NUM_MI 0 \
  CONFIG.NUM_NMI 0 \
  CONFIG.NUM_NSI 0 \
  CONFIG.NUM_SI 2 \
] [get_bd_cells axi_noc_mc_ddr4_0]
create_bd_cell -type ip -vlnv xilinx.com:ip:axi_noc:1.1 axi_noc_dma_0
set_property -dict {CONFIG.NUM_CLKS 2 CONFIG.NUM_MI 1 CONFIG.NUM_SI 1} [get_bd_cells axi_noc_dma_0]

# ---- connections ----

connect_bd_intf_net -intf_net axi_noc_0_M00_AXI [get_bd_intf_pins cips/NOC_CPM_PCIE_0] [get_bd_intf_pins axi_noc_dma_0/M00_AXI]
connect_bd_intf_net [get_bd_intf_pins axi_noc_mc_ddr4_0/CH0_DDR4_0] [get_bd_intf_ports psDDR]
connect_bd_intf_net [get_bd_intf_ports mAxi] [get_bd_intf_pins cips/CPM_PL_AXI1]
connect_bd_intf_net [get_bd_intf_pins cips/LPD_AXI_NOC_0] [get_bd_intf_pins axi_noc_mc_ddr4_0/S01_AXI]
connect_bd_intf_net [get_bd_intf_pins cips/PCIE1_GT] [get_bd_intf_ports gtPcie]
connect_bd_intf_net [get_bd_intf_pins cips/PMC_NOC_AXI_0] [get_bd_intf_pins axi_noc_mc_ddr4_0/S00_AXI]
connect_bd_intf_net -intf_net gt_pcie_refclk_1 [get_bd_intf_ports gtPcieRefClk] [get_bd_intf_pins cips/gt_refclk1]
connect_bd_intf_net [get_bd_intf_ports sAxi] [get_bd_intf_pins axi_noc_dma_0/S00_AXI]
connect_bd_intf_net -intf_net sys_clk0_0_1 [get_bd_intf_ports psDdrClk] [get_bd_intf_pins axi_noc_mc_ddr4_0/sys_clk0]
connect_bd_net -net aclk3_0_1 [get_bd_ports dmaClk] \
  [get_bd_pins cips/dma1_intrfc_clk] [get_bd_pins cips/cpm_pl_axi1_clk] [get_bd_pins axi_noc_dma_0/aclk0]
connect_bd_net [get_bd_pins cips/bridge1_usr_irq_ack] [get_bd_ports dmaAck]
connect_bd_net [get_bd_pins cips/lpd_axi_noc_clk] [get_bd_pins axi_noc_mc_ddr4_0/aclk1]
connect_bd_net [get_bd_pins cips/noc_cpm_pcie_axi0_clk] [get_bd_pins axi_noc_dma_0/aclk1]
connect_bd_net [get_bd_pins cips/pl0_ref_clk] [get_bd_ports plRefClk]
connect_bd_net [get_bd_pins cips/pl0_resetn] [get_bd_ports plRstN]
connect_bd_net [get_bd_pins cips/pmc_axi_noc_axi0_clk] [get_bd_pins axi_noc_mc_ddr4_0/aclk0]
connect_bd_net -net cpm_irq1_0_1 [get_bd_ports dmaIrq] [get_bd_pins cips/bridge1_usr_irq_req]
connect_bd_net -net dma1_intrfc_resetn_0_1 [get_bd_ports dmaRstN] [get_bd_pins cips/dma1_intrfc_resetn]

# ---- address map ----
assign_bd_address -offset 0x20200000000 -range 1G -target_address_space [get_bd_addr_spaces cips/CPM_PCIE_NOC_1] [get_bd_addr_segs mAxi/Reg]
assign_bd_address -offset 0x0000000000000000 -range 16M -target_address_space [get_bd_addr_spaces cips/CPM_PL_AXI1] [get_bd_addr_segs mAxi/Reg]
assign_bd_address -offset 0x0000000000000000 -range 2G -target_address_space [get_bd_addr_spaces cips/LPD_AXI_NOC_0] [get_bd_addr_segs axi_noc_mc_ddr4_0/S01_AXI/C1_DDR_LOW0]
assign_bd_address -offset 0x0000050000000000 -range 2G -target_address_space [get_bd_addr_spaces cips/LPD_AXI_NOC_0] [get_bd_addr_segs axi_noc_mc_ddr4_0/S01_AXI/C1_DDR_CH1]
assign_bd_address -offset 0x0000000000000000 -range 2G -target_address_space [get_bd_addr_spaces cips/PMC_NOC_AXI_0] [get_bd_addr_segs axi_noc_mc_ddr4_0/S00_AXI/C0_DDR_LOW0]
assign_bd_address -offset 0x0000050000000000 -range 2G -target_address_space [get_bd_addr_spaces cips/PMC_NOC_AXI_0] [get_bd_addr_segs axi_noc_mc_ddr4_0/S00_AXI/C0_DDR_CH1]
assign_bd_address -offset 0x00000000E0000000 -range 256M -target_address_space [get_bd_addr_spaces sAxi] [get_bd_addr_segs cips/NOC_CPM_PCIE_0/pspmc_0_psv_noc_pcie_0]
assign_bd_address -offset 0x0000000600000000 -range 8G -target_address_space [get_bd_addr_spaces sAxi] [get_bd_addr_segs cips/NOC_CPM_PCIE_0/pspmc_0_psv_noc_pcie_1]
assign_bd_address -offset 0x0000008000000000 -range 256G -target_address_space [get_bd_addr_spaces sAxi] [get_bd_addr_segs cips/NOC_CPM_PCIE_0/pspmc_0_psv_noc_pcie_2]

validate_bd_design
save_bd_design
